# EAGLE schematic schAlim2 (EAGLE 8.6.0)
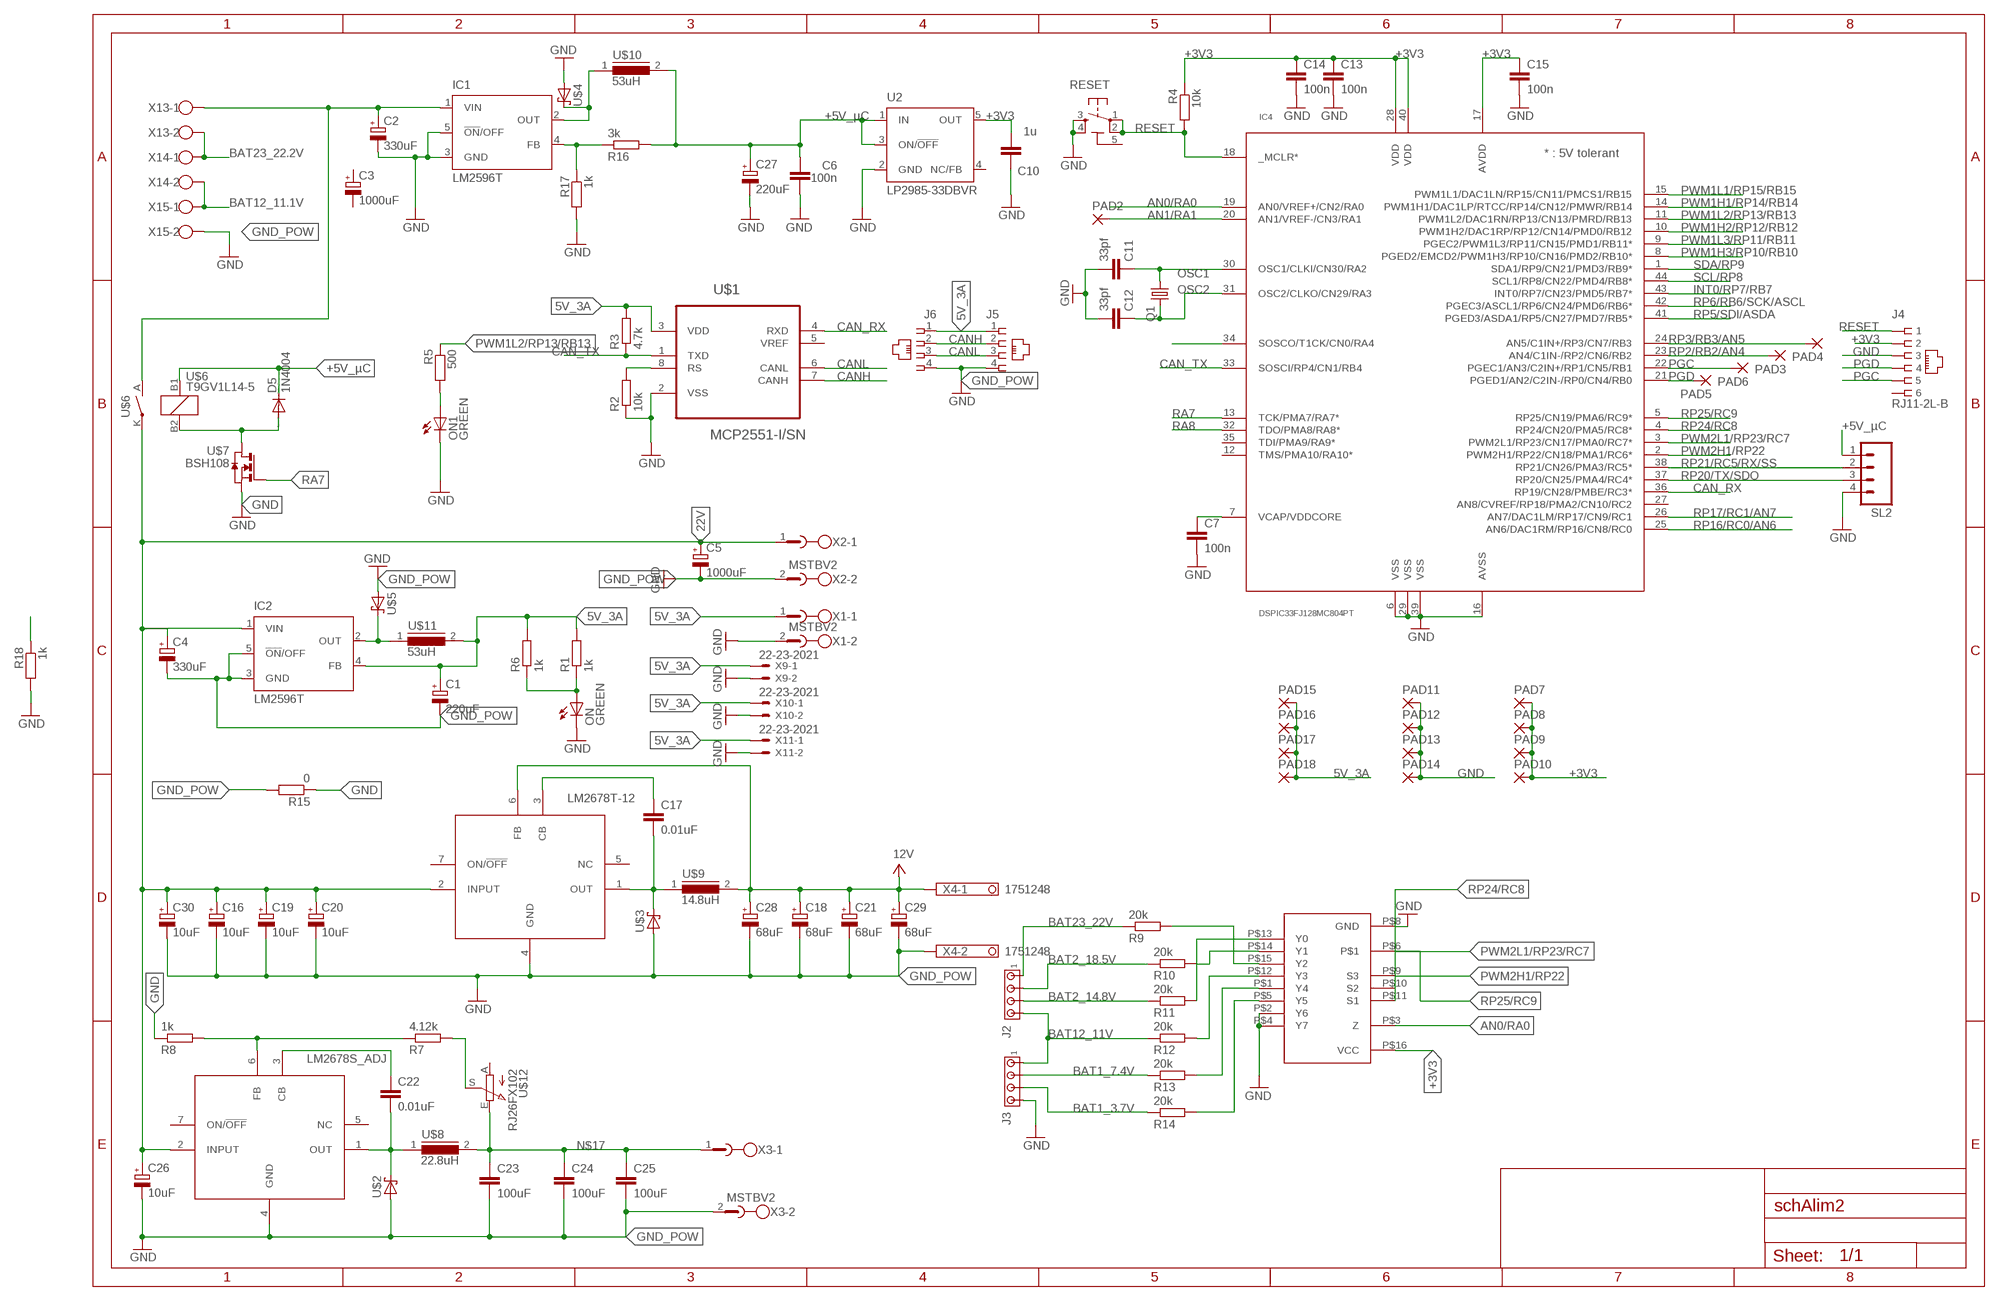
[diagram p0: schematic, sheet 1]

## Parts
C1  220uF  CPOL-EUD/7343-31W  [D/7343-31W]
C2  330uF  CPOL-EUD/7343-31W  [D/7343-31W]
C3  1000uF  CPOL-EUE7.5-16  [E7,5-16]
C4  330uF  CPOL-EUD/7343-31W  [D/7343-31W]
C5  1000uF  CPOL-EUE7.5-16  [E7,5-16]
C6  100n  C-EU0603-RND  [C0603-ROUND]
C7  100n  C-EUC0603K  [C0603K]
C10  1u  C-EU0603-RND  [C0603-ROUND]
C11  33pf  C-EUC0603  [C0603]
C12  33pf  C-EUC0603  [C0603]
C13  100n  C-EUC0603  [C0603]
C14  100n  C-EUC0603  [C0603]
C15  100n  C-EUC0603  [C0603]
C16  10uF  CPOL-EUD/7343-31W  [D/7343-31W]
C17  0.01uF  C-EUC0603  [C0603]
C18  68uF  CPOL-EUD/7343-31W  [D/7343-31W]
C19  10uF  CPOL-EUD/7343-31W  [D/7343-31W]
C20  10uF  CPOL-EUD/7343-31W  [D/7343-31W]
C21  68uF  CPOL-EUD/7343-31W  [D/7343-31W]
C22  0.01uF  C-EUC0603  [C0603]
C23  100uF  C-EUC1210  [C1210]
C24  100uF  C-EUC1210  [C1210]
C25  100uF  C-EUC1210  [C1210]
C26  10uF  CPOL-EUD/7343-31W  [D/7343-31W]
C27  220uF  CPOL-EUD/7343-31W  [D/7343-31W]
C28  68uF  CPOL-EUD/7343-31W  [D/7343-31W]
C29  68uF  CPOL-EUD/7343-31W  [D/7343-31W]
C30  10uF  CPOL-EUD/7343-31W  [D/7343-31W]
D5  1N4004  [DO41-10]
IC1  LM2596T  [T05D]
IC2  LM2596T  [T05D]
IC4  DSPIC33FJ128MC804PT  [TQFP44]
J2  MTA04-100  [10X04MTA]
J3  MTA04-100  [10X04MTA]
J4  RJ11-2L-B  [RJ11-NO_SHIELD]
J5  520249-2  [520249-2]
J6  520249-2  [520249-2]
LM2678S_ADJ  LM2678  [TO-220-7]
LM2678T-12  LM2678  [TO-220-7]
ON  GREEN  LEDCHIP-LED0805  [CHIP-LED0805]
ON1  GREEN  LEDCHIP-LED0805  [CHIP-LED0805]
PAD2  1,6/0,9  [1,6/0,9]
PAD3  1,6/0,9  [1,6/0,9]
PAD4  1,6/0,9  [1,6/0,9]
PAD5  1,6/0,9  [1,6/0,9]
PAD6  1,6/0,9  [1,6/0,9]
PAD7  1,6/0,9  [1,6/0,9]
PAD8  1,6/0,9  [1,6/0,9]
PAD9  1,6/0,9  [1,6/0,9]
PAD10  1,6/0,9  [1,6/0,9]
PAD11  1,6/0,9  [1,6/0,9]
PAD12  1,6/0,9  [1,6/0,9]
PAD13  1,6/0,9  [1,6/0,9]
PAD14  1,6/0,9  [1,6/0,9]
PAD15  1,6/0,9  [1,6/0,9]
PAD16  1,6/0,9  [1,6/0,9]
PAD17  1,6/0,9  [1,6/0,9]
PAD18  1,6/0,9  [1,6/0,9]
Q1  CRYSTALSM49  [SM49]
R1  1k  R-EU_R0805  [R0805]
R2  10k  R-EU_R0805  [R0805]
R3  4.7k  R-EU_R0805  [R0805]
R4  10k  R-EU_R0805  [R0805]
R5  500  R-EU_R0805  [R0805]
R6  1k  R-EU_R0805  [R0805]
R7  4.12k  R-EU_R0805  [R0805]
R8  1k  R-EU_R0805  [R0805]
R9  20k  R-EU_R0805  [R0805]
R10  20k  R-EU_R0805  [R0805]
R11  20k  R-EU_R0805  [R0805]
R12  20k  R-EU_R0805  [R0805]
R13  20k  R-EU_R0805  [R0805]
R14  20k  R-EU_R0805  [R0805]
R15  0  R-EU_R0805  [R0805]
R16  3k  R-EU_R0805  [R0805]
R17  1k  R-EU_R0805  [R0805]
R18  1k  R-EU_R0805  [R0805]
RESET  TS42031-160R-TR-7260  TS42  [TS42]
SL2  M04  [04P]
U2  LP2985-33DBVR  LP2985-XXDBVR33  [SOT23-DBV]
U$1  MCP2551-I/SN  [SOIC127P600X175-8N]
U$2  SCHOTTKY_TO220  [TO220ACS]
U$3  SCHOTTKY_TO220  [TO220ACS]
U$4  1N5820  [DO-201AD]
U$5  1N5820  [DO-201AD]
U$6  T9GV1L14-5  [T9G]
U$7  BSH108  [SOT23]
U$8  22.8uH  P0841NL  [KM-3.0]
U$9  14.8uH  P0846NL  [KM-2.1]
U$10  53uH  PE-54039NL  [KM-3.0_5V3A]
U$11  53uH  PE-54039NL  [KM-3.0_5V3A]
U$12  RJ26FX102  [RJ6S]
U$13  NX3L4051PW  [SOT403]
X1  MSTBV2  [MSTBV2]
X2  MSTBV2  [MSTBV2]
X3  MSTBV2  [MSTBV2]
X4  1751248  [1751248]
X9  22-23-2021  [22-23-2021]
X10  22-23-2021  [22-23-2021]
X11  22-23-2021  [22-23-2021]
X13  W237-102  [W237-102]
X14  W237-102  [W237-102]
X15  W237-102  [W237-102]

## Nets
5V_3A: C1.+ IC2.4(FB) J5.1 J6.1 PAD15.1(P) PAD16.1(P) PAD17.1(P) PAD18.1(P) R1.2 R3.2 R6.2 U$1.3(VDD) U$11.2 X1.1 X9.1 X10.1 X11.1
22V: C4.+ C5.+ C16.+ C19.+ C20.+ C26.+ C30.+ IC2.1(VIN) LM2678S_ADJ.2(INPUT) LM2678T-12.2(INPUT) U$6.K(P) X2.1
+3V3: C10.2 C13.1 C14.1 C15.1 IC4.17(AVDD) IC4.28(VDD) IC4.40(VDD) J4.2 PAD7.1(P) PAD8.1(P) PAD9.1(P) PAD10.1(P) R4.1 U2.5(OUT) U$13.P$16(VCC)
+5V_µC: C6.2 C27.+ D5.C R16.2 SL2.1 U2.1(IN) U2.3(ON/!OFF) U$6.B1 U$10.2
AN0/RA0: IC4.19(AN0/VREF+/CN2/RA0) U$13.P$3(Z)
AN1/RA1: IC4.20(AN1/VREF-/CN3/RA1) PAD2.1(P)
BAT1_3.7V: J3.3 R14.1
BAT1_7.4V: J3.2 R13.1
BAT2_14.8V: J2.3 R11.1
BAT2_18.5V: J2.2 R10.1
BAT3+: C2.+ IC1.1(VIN) U$6.A(S) X13.1
BAT12_11.1V: X14.2 X15.1
BAT12_11V: J2.4 J3.1 R12.1
BAT23_22.2V: X13.2 X14.1
BAT23_22V: J2.1 R9.1
CAN_RX: IC4.36(RP19/CN28/PMBE/RC3*) U$1.4(RXD)
CAN_TX: IC4.33(SOSCI/RP4/CN1/RB4) R3.1 U$1.1(TXD)
CANH: J5.2 J6.2 U$1.7(CANH)
CANL: J5.3 J6.3 U$1.6(CANL)
GND: C2.- C6.1 C7.2 C10.1 C11.2 C12.2 C13.2 C14.2 C15.2 C27.- IC1.3(GND) IC1.5(!ON!/OFF) IC4.6(VSS) IC4.16(AVSS) IC4.29(VSS) IC4.39(VSS) J3.4 J4.3 ON1.C ON.C PAD11.1(P) PAD12.1(P) PAD13.1(P) PAD14.1(P) R2.1 R8.1 R15.1 R17.2 R18.2 RESET.3 RESET.4 SL2.4 U2.2(GND) U$1.2(VSS) U$4.A U$7.2(S) U$13.P$2(Y6) U$13.P$4(Y7) U$13.P$8(GND)
GND_POW: C1.- C4.- C5.- C16.- C18.- C19.- C20.- C21.- C23.2 C24.2 C25.2 C26.- C28.- C29.- C30.- IC2.3(GND) IC2.5(!ON!/OFF) J5.4 J6.4 LM2678S_ADJ.4(GND) LM2678T-12.4(GND) R15.2 U$2.A U$3.A U$5.A X1.2 X2.2 X3.2 X4.2 X9.2 X10.2 X11.2 X15.2 ; supply symbol labelled GND
INT0/RP7/RB7: IC4.43(INT0/RP7/CN23/PMD5/RB7*)
N$1: ON1.A R5.2
N$2: ON.A R1.1 R6.1
N$3: R18.1
N$4: R9.2 U$13.P$15(Y2)
N$5: C7.1 IC4.7(VCAP/VDDCORE)
N$6: R11.2 U$13.P$13(Y0)
N$7: LM2678S_ADJ.6(FB) R7.1 R8.2
N$8: R2.2 U$1.8(RS)
N$9: IC2.2(OUT) U$5.C U$11.1
N$10: IC4.34(SOSCO/T1CK/CN0/RA4)
N$11: C17.2 LM2678T-12.1(OUT) U$3.C U$9.1
N$12: IC1.2(OUT) U$4.C U$10.1
N$13: C22.1 LM2678S_ADJ.3(CB)
N$14: C17.1 LM2678T-12.3(CB)
N$15: R12.2 U$13.P$12(Y3)
N$16: C22.2 LM2678S_ADJ.1(OUT) U$2.C U$8.1
N$17: C23.1 C24.1 C25.1 U$8.2 U$12.E X3.1
N$18: D5.A U$6.B2 U$7.3(D)
N$19: R7.2 U$12.S
N$20: R13.2 U$13.P$1(Y4)
N$21: R10.2 U$13.P$14(Y1)
N$22: R14.2 U$13.P$5(Y5)
N$23: IC1.4(FB) R16.1 R17.1
OSC1: C11.1 IC4.30(OSC1/CLKI/CN30/RA2) Q1.1
OSC2: C12.1 IC4.31(OSC2/CLKO/CN29/RA3) Q1.2
PGC: IC4.22(PGEC1/AN3/C2IN+/RP1/CN5/RB1) J4.5 PAD6.1(P)
PGD: IC4.21(PGED1/AN2/C2IN-/RP0/CN4/RB0) J4.4 PAD5.1(P)
PWM1H1/RP14/RB14: IC4.14(PWM1H1/DAC1LP/RTCC/RP14/CN12/PMWR/RB14)
PWM1H2/RP12/RB12: IC4.10(PWM1H2/DAC1RP/RP12/CN14/PMD0/RB12)
PWM1H3/RP10/RB10: IC4.8(PGED2/EMCD2/PWM1H3/RP10/CN16/PMD2/RB10*)
PWM1L1/RP15/RB15: IC4.15(PWM1L1/DAC1LN/RP15/CN11/PMCS1/RB15)
PWM1L2/RP13/RB13: IC4.11(PWM1L2/DAC1RN/RP13/CN13/PMRD/RB13) R5.1
PWM1L3/RP11/RB11: IC4.9(PGEC2/PWM1L3/RP11/CN15/PMD1/RB11*)
PWM2H1/RP22: IC4.2(PWM2H1/RP22/CN18/PMA1/RC6*) U$13.P$9(S3)
PWM2L1/RP23/RC7: IC4.3(PWM2L1/RP23/CN17/PMA0/RC7*) U$13.P$10(S2)
RA7: IC4.13(TCK/PMA7/RA7*) U$7.1(G)
RA8: IC4.32(TDO/PMA8/RA8*)
RESET: IC4.18(_MCLR*) J4.1 R4.2 RESET.1 RESET.2
RP2/RB2/AN4: IC4.23(AN4/C1IN-/RP2/CN6/RB2) PAD3.1(P)
RP3/RB3/AN5: IC4.24(AN5/C1IN+/RP3/CN7/RB3) PAD4.1(P)
RP5/SDI/ASDA: IC4.41(PGED3/ASDA1/RP5/CN27/PMD7/RB5*)
RP6/RB6/SCK/ASCL: IC4.42(PGEC3/ASCL1/RP6/CN24/PMD6/RB6*)
RP16/RC0/AN6: IC4.25(AN6/DAC1RM/RP16/CN8/RC0)
RP17/RC1/AN7: IC4.26(AN7/DAC1LM/RP17/CN9/RC1)
RP20/TX/SDO: IC4.37(RP20/CN25/PMA4/RC4*) SL2.3
RP21/RC5/RX/SS: IC4.38(RP21/CN26/PMA3/RC5*) SL2.2
RP24/RC8: IC4.4(RP24/CN20/PMA5/RC8*) U$13.P$11(S1)
RP25/RC9: IC4.5(RP25/CN19/PMA6/RC9*) U$13.P$6
SCL/RP8: IC4.44(SCL1/RP8/CN22/PMD4/RB8*)
SDA/RP9: IC4.1(SDA1/RP9/CN21/PMD3/RB9*)
V+: C18.+ C21.+ C28.+ C29.+ LM2678T-12.6(FB) U$9.2 X4.1 ; supply symbol labelled 12V
Unconnected: C3.+ C3.- IC4.12(TMS/PMA10/RA10*) IC4.27(AN8/CVREF/RP18/PMA2/CN10/RC2) IC4.35(TDI/PMA9/RA9*) J4.6 LM2678S_ADJ.5(NC) LM2678S_ADJ.7(ON/!OFF!) LM2678T-12.5(NC) LM2678T-12.7(ON/!OFF!) U2.4(NC/FB) U$1.5(VREF) U$12.A

## Power pins joined to a net without a drawn wire
5-GND: RESET.5(5-GND)

## Library data of the parts
C1 C27 = rcl:CPOL-EU: POLARIZED CAPACITOR, European symbol; OC_FARNELL: 2283872; SPICEPREFIX: C
C2 C4 = rcl:CPOL-EU: POLARIZED CAPACITOR, European symbol; OC_FARNELL: 1135198; SPICEPREFIX: C
C3 C5 = rcl:CPOL-EU: POLARIZED CAPACITOR, European symbol; SPICEPREFIX: C
C6 C7 = SmartPrj:C-EU: CAPACITOR, European symbol; OC_FARNELL: 2210925
C10 = SmartPrj:C-EU: CAPACITOR, European symbol; OC_FARNELL: 2346901
C11 C12 = LibPerso:C-EU: CAPACITOR, European symbol; OC_FARNELL: 1740598
C13-C15 = LibPerso:C-EU: CAPACITOR, European symbol; OC_FARNELL: 2210925
C16 C19 C20 C30 = rcl:CPOL-EU: POLARIZED CAPACITOR, European symbol; OC_FARNELL: 2424754; SPICEPREFIX: C
C17 C22 = rcl:C-EU: CAPACITOR, European symbol; SPICEPREFIX: C
C18 C21 C28 C29 = rcl:CPOL-EU: POLARIZED CAPACITOR, European symbol; OC_FARNELL: 2524603; SPICEPREFIX: C
C23-C25 = rcl:C-EU: CAPACITOR, European symbol; OC_FARNELL: 1658510; SPICEPREFIX: C
C26 = rcl:CPOL-EU: POLARIZED CAPACITOR, European symbol; OC_FARNELL: 1432608; SPICEPREFIX: C
D5 = diode:1N4004: DIODE general purpose rectifier, 1 A
IC1 IC2 = national-semiconductor:LM2596: SIMPLE SWITCHER® Power Converter 150 kHz 3A Step-Down Voltage Regulator Source: http://www.national.com/ds/LM/LM2596.pdf; MPN: LM2596T-ADJ/LF02; OC_FARNELL: 9494162; OC_NEWARK: 65K5910
IC4 = microchip-dspic33:DSPIC33F*04
J2 J3 = con-amp:MTA04-100: AMP connector
J4 = LibPerso:RJ11: CORCOM Modular RJ Jacks No Shield Source: www.tycoelectronics.com .. ENG_DS_1654001_1099_RJ_L_0507.pdf; MF: TYCO ELECTRONICS; MPN: RJ11-2L-B; OC_FARNELL: 1393306; OC_NEWARK: 83F4463
J5 J6 = LibPerso:520249-2: AMP connector; OC_FARNELL: 1137972; OC_RS: 477-359
LM2678S_ADJ = Robot_MT:LM2678; OC_FARNELL: 9778357; SPICEPREFIX: X
LM2678T-12 = Robot_MT:LM2678; OC_FARNELL: 9778357
ON ON1 = led:LED: LED OSRAM: - CHIPLED LG R971, LG N971, LY N971, LG Q971, LY Q971, LO R971, LY R971 LH N974, LH R974 LS Q976, LO Q976, LY Q976 LO Q996 - Hyper CHIPLED LW Q18S LB Q993, LB Q99A, LB R99A - SideLED LS A670, LO A670, LY A670, LG A670, LP A670 LB A673, LV A673, LT A673, LW A673 LH A674 LY A675 LS A676, LA A676, LO A676, LY A676, LW A676 LS A679, LY A679, LG A679 - Hyper Micro SIDELED® LS Y876, LA Y876, LO Y876, LY Y876 LT Y87S - SmartLED LW L88C, LW L88S LB L89C, LB L89S, LG L890 LS L89K, LO L89K, LY L89K LS L896, LA L896, LO L896, LY L896 - TOPLED LS T670, LO T670, LY T670, LG T670, LP T670 LSG T670, LSP T670, LSY T670, LOP T670, LYG T670 LG T671, LOG T671, LSG T671 LB T673, LV T673, LT T673, LW T673 LH T674 LS T676, LA T676, LO T676, LY T676, LB T676, LH T676, LSB T676, LW T676 LB T67C, LV T67C, LT T67C, LS T67K, LO T67K, LY T67K, LW E67C LS E67B, LA E67B, LO E67B, LY E67B, LB E67C, LV E67C, LT E67C LW T67C LS T679, LY T679, LG T679 LS T770, LO T770, LY T770, LG T770, LP T770 LB T773, LV T773, LT T773, LW T773 LH T774 LS E675, LA E675, LY E675, LS T675 LS T776, LA T776, LO T776, LY T776, LB T776 LHGB T686 LT T68C, LB T68C - Hyper Mini TOPLED® LB M676 - Mini TOPLED Santana® LG M470 LS M47K, LO M47K, LY M47K Source: http://www.osram.convergy.de LUXEON: - LUMILED® LXK2-PW12-R00, LXK2-PW12-S00, LXK2-PW14-U00, LXK2-PW14-V00 LXK2-PM12-R00, LXK2-PM12-S00, LXK2-PM14-U00 LXK2-PE12-Q00, LXK2-PE12-R00, LXK2-PE12-S00, LXK2-PE14-T00, LXK2-PE14-U00 LXK2-PB12-K00, LXK2-PB12-L00, LXK2-PB12-M00, LXK2-PB14-N00, LXK2-PB14-P00, LXK2-PB14-Q00 LXK2-PR12-L00, LXK2-PR12-M00, LXK2-PR14-Q00, LXK2-PR14-R00 LXK2-PD12-Q00, LXK2-PD12-R00, LXK2-PD12-S00 LXK2-PH12-R00, LXK2-PH12-S00 LXK2-PL12-P00, LXK2-PL12-Q00, LXK2-PL12-R00 Source: www.luxeon.com KINGBRIGHT: KA-3528ASYC Source: www.kingbright.com; OC_FARNELL: 8529906
PAD2-PAD18 = wirepad:1,6/0,9: THROUGH-HOLE PAD
Q1 = crystal:CRYSTAL: CRYSTAL; OC_FARNELL: 1842332; OC_NEWARK: unknown
R1-R4 R6 R9-R15 = LibPerso:R-EU_: RESISTOR, European symbol
R5 R7 R8 R16-R18 = resistor:R-EU_: RESISTOR, European symbol
RESET = SmartPrj:TS42: TS42 Dongnan Electronics Tact switch VDC 12V - 50mA; OC_FARNELL: 2060823
SL2 = con-amp-quick:M04: AMP QUICK CONNECTOR; OC_FARNELL: unknown; OC_NEWARK: unknown
U2 = SmartPrj:LP2985-XXDBVR: ULTRALOW-POWER 50-mA LOW-DROPOUT LINEAR REGULATORS 50-mA Low-Dropout Regulator Source: http://focus.ti.com/lit/ds/symlink/tps77001.pdf; OC_FARNELL: 2395925
U$1 = LibPerso:MCP2551-I/SN: High-Speed CAN Transceiver; MPN: MCP2551-I/SN; OC_FARNELL: 9758569; OC_NEWARK: 69K7604; PACKAGE: SOIC-8; SUPPLIER: Microchip
U$2 = Robot_MT:SCHOTTKY_TO220; OC_FARNELL: 2677696
U$3 = Robot_MT:SCHOTTKY_TO220; OC_FARNELL: 9557296
U$4 U$5 = Robot_MT:1N5820; OC_FARNELL: 1017590
U$6 = Robot_MT:T9GV1L14-5; OC_FARNELL: 2857449
U$7 = Robot_MT:BSH108
U$8 = Robot_MT:P0841NL; OC_FARNELL: 2215927
U$9 = Robot_MT:P0846NL; OC_FARNELL: 2215928
U$10 U$11 = Robot_MT:PE-54039NL; OC_FARNELL: 2215963
U$12 = Robot_MT:RJ26FX102
U$13 = Robot_MT:NX3L4051PW; OC_FARNEL: 2775927
X1-X3 = con-phoenix-508:MSTBV2: PHOENIX; MPN: MSTBV 2,5/2-GF-5.08; OC_FARNELL: 1792792; OC_NEWARK: 69R9845
X4 = con-phoenix-350:1751248: MKDS 1/ 2-3,5 Printklemme Nennstrom: 10 A Bemessungsspannung: 160 V Raster: 3,5 mm Polzahl: 2 Montageart: Löten Anschlussart: Schraubanschluss Anschlussrichtung vom Leiter zur Platine: 0° Source: http://eshop.phoenixcontact.com .. 1751248.pdf; OC_FARNELL: unknown; OC_NEWARK: unknown
X9-X11 = con-molex:22-23-2021: .100" (2.54mm) Center Header - 2 Pin; MF: MOLEX; MPN: 22-23-2021; OC_FARNELL: 1462926; OC_NEWARK: 25C3832
X13-X15 = con-wago-500:W237-102: WAGO SCREW CLAMP; MPN: 237-102; OC_FARNELL: unknown; OC_NEWARK: 70K9898

## Net classes
0 default: width 0.254 mm, clearance 0.254 mm